# Altium schematic sheet OMD_F7_CAN_60V_layout.SchDoc
size A4; Organization: Altium Limited; Address1: L3, 12a Rodborough Rd; Address2: Frenchs Forest; Address3: NSW; Address4: Australia 2086
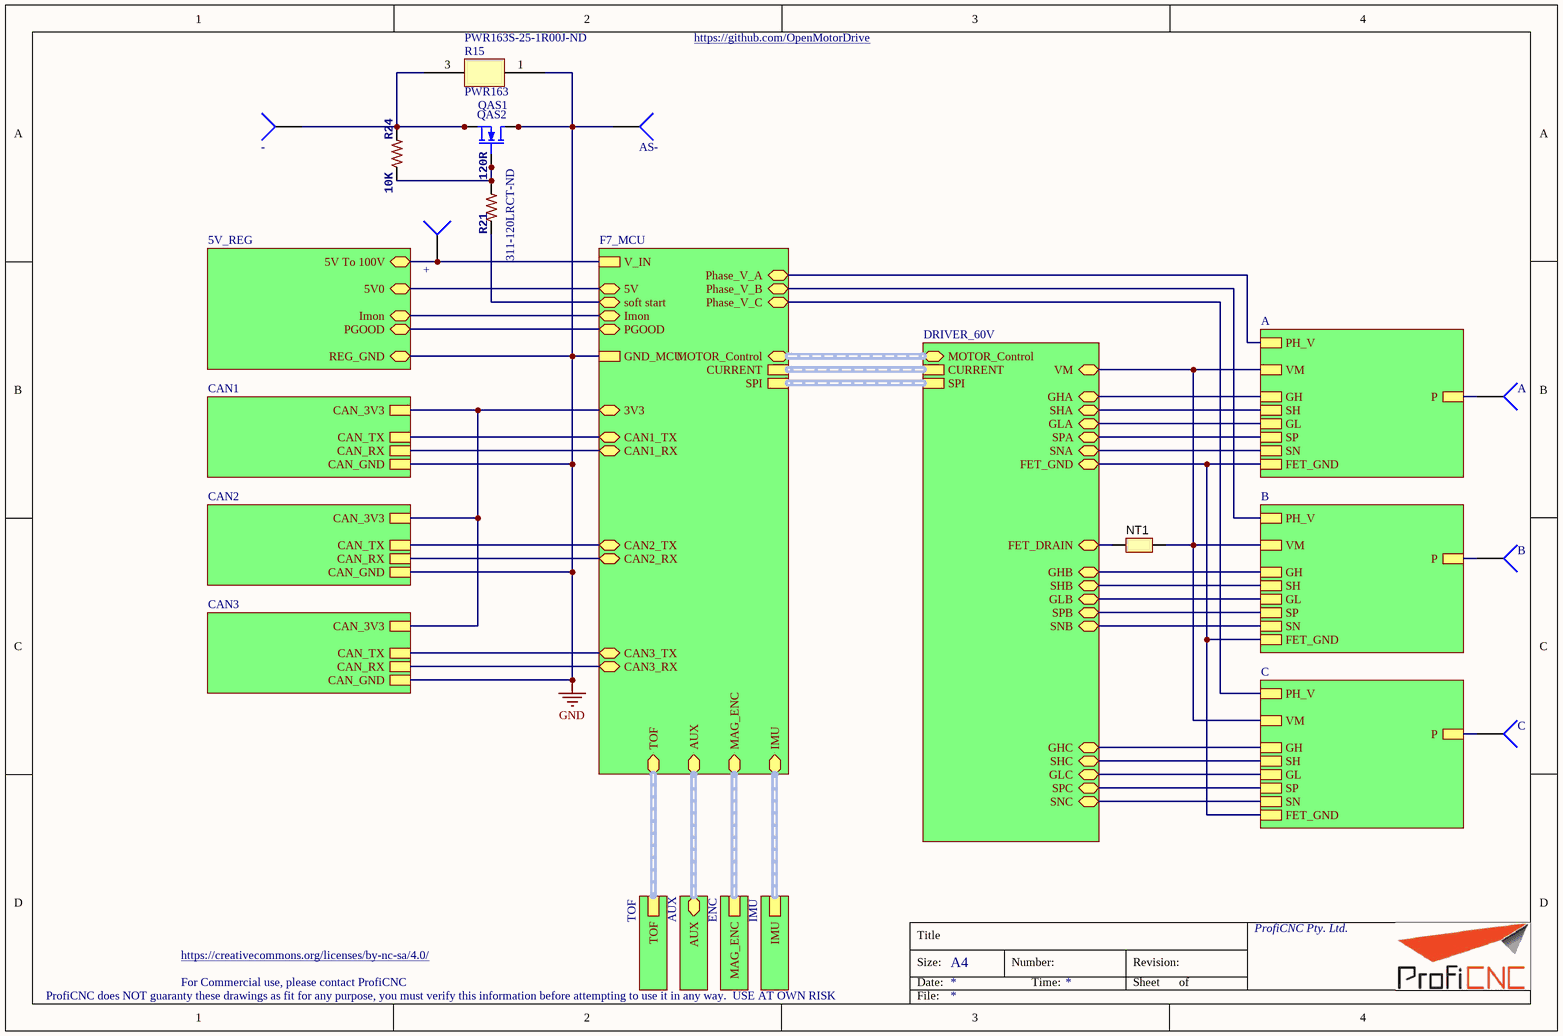
[diagram p0: OMD_F7_CAN_60V_layout.SchDoc]

## Parts
+  BATT  [MOTOR_PLUG_F_3.5]  (value not drawn)
-  GND  [MOTOR_PLUG_F_3.5]  (value not drawn)  (no BOM)
A  Motor_pad  [MOTOR_PLUG_F_3.5]  (value not drawn)
AS-  GND  [MOTOR_PLUG_F_3.5]  (value not drawn)  (no BOM)
B  Motor_pad  [MOTOR_PLUG_F_3.5]  (value not drawn)
C  Motor_pad  [MOTOR_PLUG_F_3.5]  (value not drawn)
NT1  Net-Tie  [Net-Tie_10mil]  (value not drawn)  (net tie, no BOM)
QAS1  MOSFET-N  [Q5B]  (value not drawn)
QAS2  MOSFET-N  [Q5B]  (value not drawn)
R15  PWR163  Supplier Part Number 1: PWR163S-25-1R00J-ND  [PWR163]
R21  120R  Supplier Part Number 1: 311-120LRCT-ND  [0402-RES]
R24  10K  [0402-RES]

## Sub-sheets
5V_REG = OMD_105V_5V_Buck.SchDoc: 5V0, REG_GND, 5V To 100V, Imon, PGOOD
A = OMD_Fets_80A.SchDoc: P, VM, GH, SH, GL, SP, SN, FET_GND, PH_V
AUX = OMD_AUX.SchDoc: AUX (harness AUX)
B = OMD_Fets_80A.SchDoc: P, VM, GH, SH, GL, SP, SN, FET_GND, PH_V
C = OMD_Fets_80A.SchDoc: P, VM, GH, SH, GL, SP, SN, FET_GND, PH_V
CAN1 = OMD_CAN_VERT.SchDoc: CAN_RX, CAN_TX, CAN_GND, CAN_3V3
CAN2 = OMD_CAN_VERT.SchDoc: CAN_RX, CAN_TX, CAN_GND, CAN_3V3
CAN3 = OMD_CAN_VERT.SchDoc: CAN_RX, CAN_TX, CAN_GND, CAN_3V3
DRIVER_60V = OMD_DRIVER_60V.SchDoc: SPI (harness SPI), CURRENT (harness I_FEEDBACK), MOTOR_Control (harness Motor control), GLA, SPB, SNB, GHC, SNA, FET_GND, SPA, SPC, FET_DRAIN, GHB, GHA, SHC, VM, GLB, SHB, SHA, SNC, GLC
ENC = OMD_Mag_Encoder.SchDoc: MAG_ENC (harness SPI_ENC)
F7_MCU = OMD_F7_MCU.SchDoc: CURRENT (harness I_FEEDBACK), V_IN, GND_MCU, SPI (harness SPI1), IMU (harness SPI_IMU), MAG_ENC (harness SPI_ENC), CAN2_TX, CAN2_RX, CAN3_TX, CAN3_RX, 3V3, 5V, CAN1_RX, CAN1_TX, Phase_V_B, Phase_V_A, Phase_V_C, TOF (harness TOF), MOTOR_Control (harness Motor control1), AUX (harness AUX), Imon, PGOOD, soft start
IMU = OMD_30G_IMU.SchDoc: IMU (harness SPI_IMU)
TOF = OMD_TOF.SchDoc: TOF (harness TOF)

## Nets
GND: AS-.1 QAS1.D QAS2.D R15.1 ; sheet F7_MCU/GND_MCU, sheet CAN1/CAN_GND, sheet CAN2/CAN_GND, sheet CAN3/CAN_GND, sheet 5V_REG/REG_GND
Net+_1: +.1 ; sheet F7_MCU/V_IN, sheet 5V_REG/5V To 100V
Net-_1: -.1 QAS1.S QAS2.S R15.3 R24.2
NetA_1: A.1 ; sheet A/P
NetB_1: B.1 ; sheet B/P
NetC_1: C.1 ; sheet C/P
NetNT1_1: NT1.1 ; sheet DRIVER_60V/FET_DRAIN
NetNT1_2: NT1.2 ; sheet DRIVER_60V/VM, sheet A/VM, sheet B/VM, sheet C/VM
NetQAS1_G: QAS1.G QAS2.G R21.2 R24.1
NetR21_1: R21.1 ; sheet F7_MCU/soft start
(unnamed): sheet DRIVER_60V/GLA, sheet A/GL
(unnamed): sheet DRIVER_60V/SPB, sheet B/SP
(unnamed): sheet DRIVER_60V/SNB, sheet B/SN
(unnamed): sheet DRIVER_60V/GHC, sheet C/GH
(unnamed): sheet DRIVER_60V/SNA, sheet A/SN
(unnamed): sheet DRIVER_60V/FET_GND, sheet A/FET_GND, sheet B/FET_GND, sheet C/FET_GND
(unnamed): sheet DRIVER_60V/SPA, sheet A/SP
(unnamed): sheet DRIVER_60V/SPC, sheet C/SP
(unnamed): sheet DRIVER_60V/GHB, sheet B/GH
(unnamed): sheet DRIVER_60V/GHA, sheet A/GH
(unnamed): sheet DRIVER_60V/SHC, sheet C/SH
(unnamed): sheet DRIVER_60V/GLB, sheet B/GL
(unnamed): sheet DRIVER_60V/SHB, sheet B/SH
(unnamed): sheet DRIVER_60V/SHA, sheet A/SH
(unnamed): sheet DRIVER_60V/SNC, sheet C/SN
(unnamed): sheet DRIVER_60V/GLC, sheet C/GL
(unnamed): sheet F7_MCU/CAN2_TX, sheet CAN2/CAN_TX
(unnamed): sheet F7_MCU/CAN2_RX, sheet CAN2/CAN_RX
(unnamed): sheet F7_MCU/CAN3_TX, sheet CAN3/CAN_TX
(unnamed): sheet F7_MCU/CAN3_RX, sheet CAN3/CAN_RX
(unnamed): sheet F7_MCU/3V3, sheet CAN1/CAN_3V3, sheet CAN2/CAN_3V3, sheet CAN3/CAN_3V3
(unnamed): sheet F7_MCU/5V, sheet 5V_REG/5V0
(unnamed): sheet F7_MCU/CAN1_RX, sheet CAN1/CAN_RX
(unnamed): sheet F7_MCU/CAN1_TX, sheet CAN1/CAN_TX
(unnamed): sheet F7_MCU/Phase_V_B, sheet B/PH_V
(unnamed): sheet F7_MCU/Phase_V_A, sheet A/PH_V
(unnamed): sheet F7_MCU/Phase_V_C, sheet C/PH_V
(unnamed): sheet F7_MCU/Imon, sheet 5V_REG/Imon
(unnamed): sheet F7_MCU/PGOOD, sheet 5V_REG/PGOOD

## Buses and harness runs
harness sheet AUX/AUX = sheet F7_MCU/AUX
harness sheet DRIVER_60V/CURRENT = sheet F7_MCU/CURRENT
harness sheet DRIVER_60V/MOTOR_Control = sheet F7_MCU/MOTOR_Control
harness sheet DRIVER_60V/SPI = sheet F7_MCU/SPI
harness sheet ENC/MAG_ENC = sheet F7_MCU/MAG_ENC
harness sheet F7_MCU/IMU = sheet IMU/IMU
harness sheet F7_MCU/TOF = sheet TOF/TOF

## Notes on the sheet
- https://github.com/OpenMotorDrive
- https://creativecommons.org/licenses/by-nc-sa/4.0/
- For Commercial use, please contact ProfiCNC
- Title
- Size:
- Date:
- A4
- Number:
- Time:
- Revision:
- Sheet
- of
- ProfiCNC Pty. Ltd.
- ProfiCNC does NOT guaranty these drawings as fit for any purpose, you must verify this information before attempting to use it in any way.  USE AT OWN RISK
- File:

## Library data of the parts
+ - A AS- B C = Socket
NT1 = Net-Tie: Single point connection between nets.
QAS1 QAS2 = MOSFET-N: N-Channel MOSFET; Supplier 1: Digi-Key; Supplier Part Number 1: 296-37194-1-ND
R15 = Resistor 25W 1R  DPAK: The PWR163 Series is a DPAK style surface mount power resistor.; Supplier 1: Digi-Key
R21 = RESISTOR0402-RES: RES 120 OHM 1/16W 1% 0402 SMD; Supplier 1: Digi-Key
R24 = RESISTOR0402-RES: RES 10K OHM 1/16W 1% 0402 SMD; Supplier 1: Digi-Key; Supplier Part Number 1: 311-10.0KLRCT-ND